# EAGLE design Adafruit FT232H (EAGLE 9.5.0)
COMPANY: ADAFRUIT INDUSTRIES; DRAWN: LADYADA; REV: A
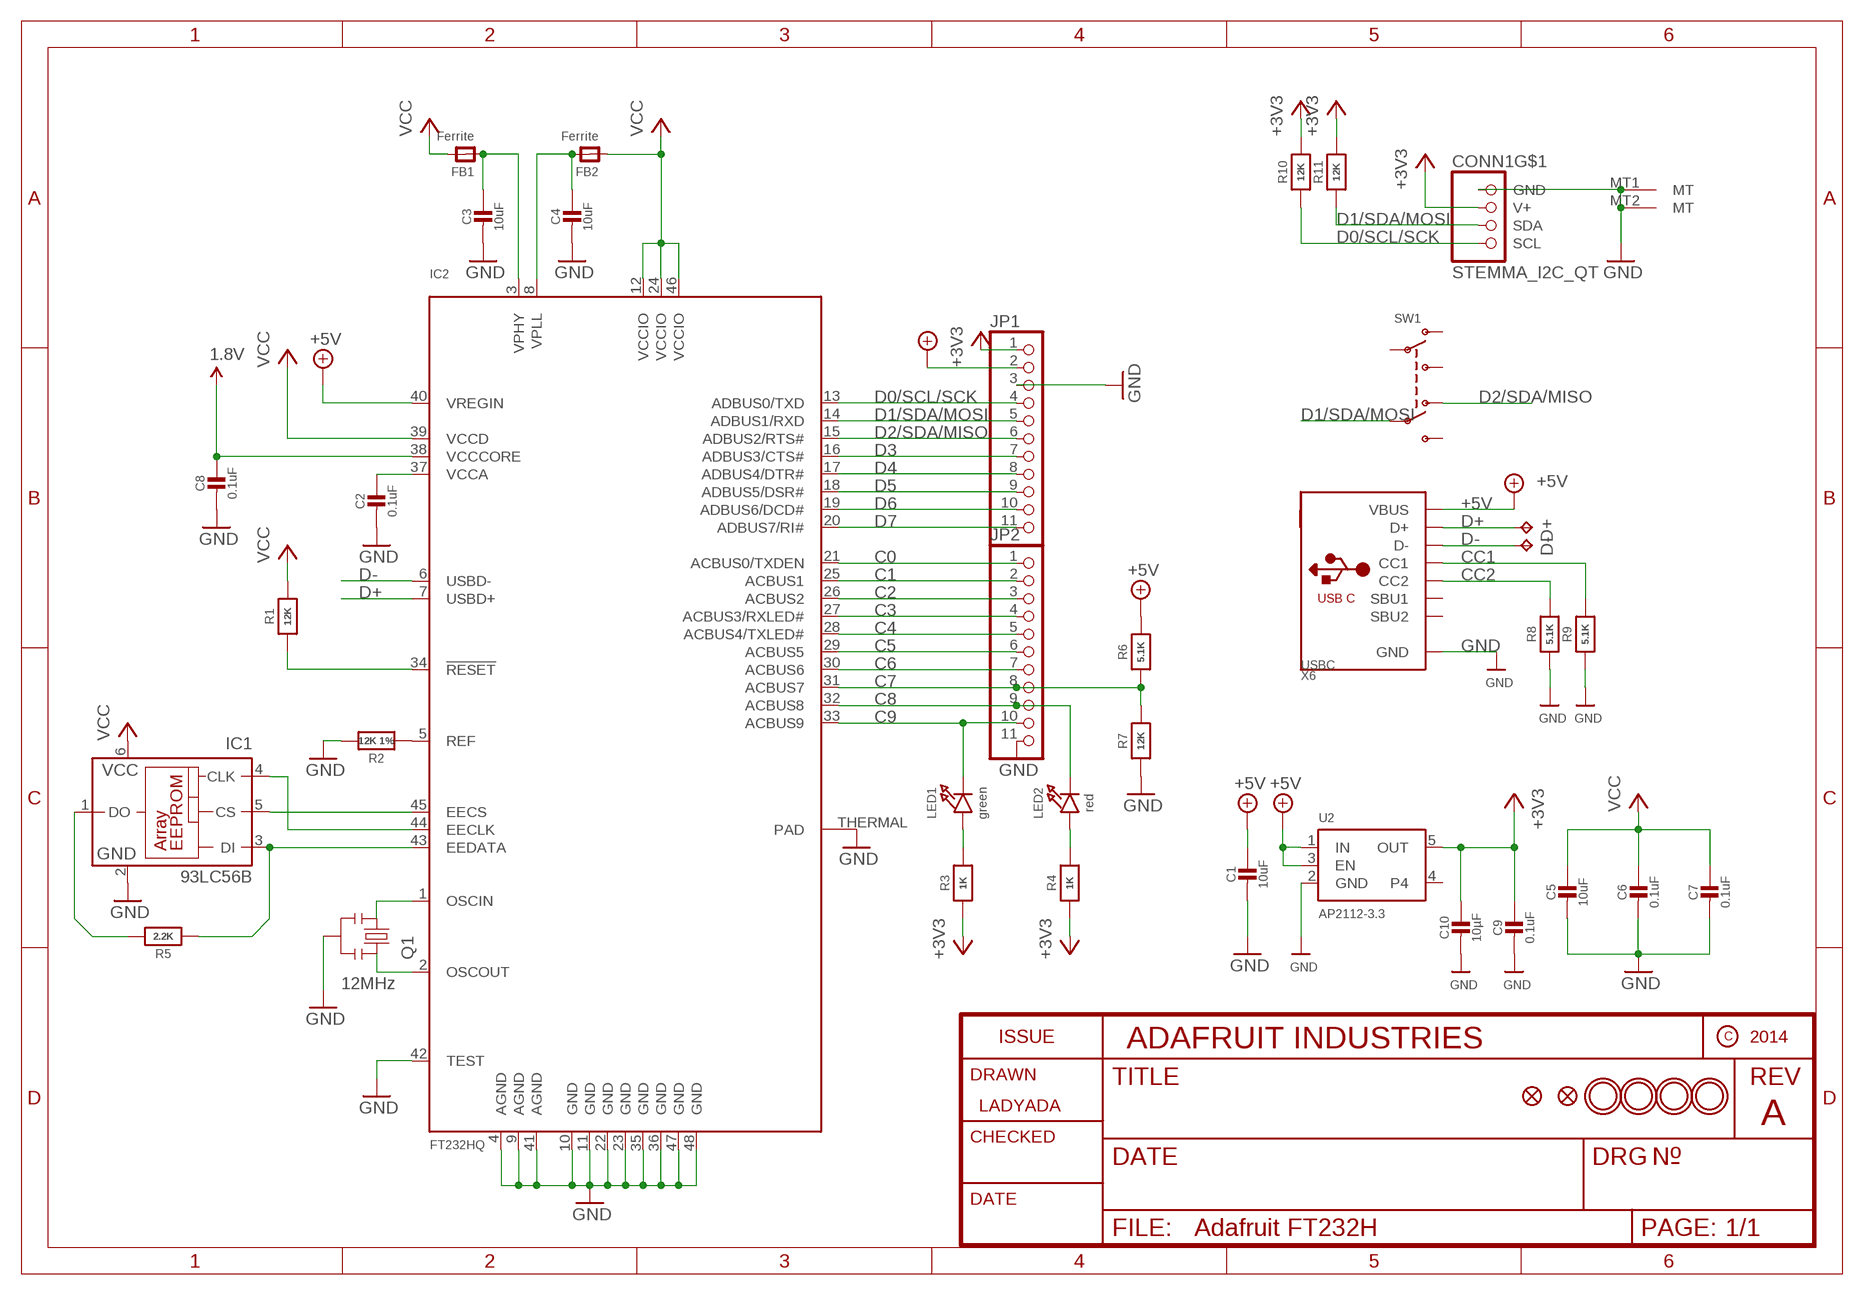
[diagram p0: schematic, sheet 1]

## Parts
C1  10uF  CAP_CERAMIC0805-NOOUTLINE  [0805-NO]
C2  0.1uF  CAP_CERAMIC0603_NO  [0603-NO]
C3  10uF  CAP_CERAMIC0805-NOOUTLINE  [0805-NO]
C4  10uF  CAP_CERAMIC0805-NOOUTLINE  [0805-NO]
C5  10uF  CAP_CERAMIC0805-NOOUTLINE  [0805-NO]
C6  0.1uF  CAP_CERAMIC0603_NO  [0603-NO]
C7  0.1uF  CAP_CERAMIC0603_NO  [0603-NO]
C8  0.1uF  CAP_CERAMIC0603_NO  [0603-NO]
C9  0.1uF  CAP_CERAMIC0603_NO  [0603-NO]
C10  10µF  CAP_CERAMIC0805-NOOUTLINE  [0805-NO]
CONN1  STEMMA_I2C_QT  [JST_SH4]
D+  TPTP17R  [TP17R]
D-  TPTP17R  [TP17R]
FB1  Ferrite  FERRITE_0805  [_0805]
FB2  Ferrite  FERRITE_0805  [_0805]
FID1  FIDUCIAL""  [FIDUCIAL_1MM]
FID2  FIDUCIAL""  [FIDUCIAL_1MM]
IC1  93LC56B  93LC76A  [SOT23-6]
IC2  FT232HQ  [QFN48_8MM]
JP1  HEADER-1X11  [1X11_ROUND]
JP2  HEADER-1X11  [1X11_ROUND]
LED1  green  LED0805_NOOUTLINE  [CHIPLED_0805_NOOUTLINE]
LED2  red  LED0805_NOOUTLINE  [CHIPLED_0805_NOOUTLINE]
Q1  12MHz  RESONATORSMD  [RESONATOR-SMD]
R1  12K  RESISTOR_0603_NOOUT  [0603-NO]
R2  12K 1%  RESISTOR_0603_NOOUT  [0603-NO]
R3  1K  RESISTOR_0603_NOOUT  [0603-NO]
R4  1K  RESISTOR_0603_NOOUT  [0603-NO]
R5  2.2K  RESISTOR_0603_NOOUT  [0603-NO]
R6  5.1K  RESISTOR_0603_NOOUT  [0603-NO]
R7  12K  RESISTOR_0603_NOOUT  [0603-NO]
R8  5.1K  RESISTOR_0603_NOOUT  [0603-NO]
R9  5.1K  RESISTOR_0603_NOOUT  [0603-NO]
R10  12K  RESISTOR_0603_NOOUT  [0603-NO]
R11  12K  RESISTOR_0603_NOOUT  [0603-NO]
SW1  SWITCH_DPDTEG1390  [EG1390]
U2  AP2112-3.3  VREG_SOT23-5  [SOT23-5]
U$4  MOUNTINGHOLE2.5  [MOUNTINGHOLE_2.5_PLATED]
U$5  MOUNTINGHOLE2.5  [MOUNTINGHOLE_2.5_PLATED]
U$6  MOUNTINGHOLE2.5  [MOUNTINGHOLE_2.5_PLATED]
U$7  MOUNTINGHOLE2.5  [MOUNTINGHOLE_2.5_PLATED]
X6  USBC  USB_C  [USB_C_CUSB31-CFM2AX-01-X]

## Nets
1.8V: C8.1 IC2.38(VCCCORE)
+3V3: C9.1 C10.1 CONN1.2(V+) JP1.1 R3.1 R4.1 R10.2 R11.2 U2.5(OUT)
+5V: C1.1 IC2.40(VREGIN) JP1.2 R6.2 U2.1(IN) U2.3(EN) X6.A4B9(VBUS) X6.B4A9(VBUS)
C0: IC2.21(ACBUS0/TXDEN) JP2.1
C1: IC2.25(ACBUS1) JP2.2
C2: IC2.26(ACBUS2) JP2.3
C3: IC2.27(ACBUS3/RXLED#) JP2.4
C4: IC2.28(ACBUS4/TXLED#) JP2.5
C5: IC2.29(ACBUS5) JP2.6
C6: IC2.30(ACBUS6) JP2.7
C7: IC2.31(ACBUS7) JP2.8 R6.1 R7.2
C8: IC2.32(ACBUS8) JP2.9 LED2.C
C9: IC2.33(ACBUS9) JP2.10 LED1.C
CC1: R9.2 X6.A5(CC1)
CC2: R8.2 X6.B5(CC2)
D0/SCL/SCK: CONN1.4(SCL) IC2.13(ADBUS0/TXD) JP1.4 R10.1
D1/SDA/MOSI: CONN1.3(SDA) IC2.14(ADBUS1/RXD) JP1.5 R11.1 SW1.P2
D2/SDA/MISO: IC2.15(ADBUS2/RTS#) JP1.6 SW1.O2
D3: IC2.16(ADBUS3/CTS#) JP1.7
D4: IC2.17(ADBUS4/DTR#) JP1.8
D5: IC2.18(ADBUS5/DSR#) JP1.9
D6: IC2.19(ADBUS6/DCD#) JP1.10
D7: IC2.20(ADBUS7/RI#) JP1.11
D+: D+.TP IC2.7(USBD+) X6.A6(D+) X6.B6(D+)
D-: D-.TP IC2.6(USBD-) X6.A7(D-) X6.B7(D-)
GND: C1.2 C2.2 C3.2 C4.2 C5.2 C6.2 C7.2 C8.2 C9.2 C10.2 CONN1.1(GND) CONN1.MT1(MT) CONN1.MT2(MT) IC1.2(GND) IC2.4(AGND) IC2.9(AGND) IC2.10(GND) IC2.11(GND) IC2.22(GND) IC2.23(GND) IC2.35(GND) IC2.36(GND) IC2.41(AGND) IC2.42(TEST) IC2.47(GND) IC2.48(GND) IC2.THERMAL(PAD) JP1.3 JP2.11 Q1.2 R2.2 R7.1 R8.1 R9.1 U2.2(GND) X6.A1B12(GND) X6.B1A12(GND)
N$2: IC2.1(OSCIN) Q1.1
N$3: IC2.2(OSCOUT) Q1.3
N$5: IC2.5(REF) R2.1
N$6: LED2.A R4.2
N$7: IC2.34(!RESET) R1.1
N$8: LED1.A R3.2
N$9: IC1.3(DI) IC2.43(EEDATA) R5.1
N$10: IC1.5(CS) IC2.45(EECS)
N$11: IC1.4(CLK) IC2.44(EECLK)
N$12: IC1.1(DO) R5.2
VCC: C5.1 C6.1 C7.1 FB1.2 FB2.1 IC1.6(VCC) IC2.12(VCCIO) IC2.24(VCCIO) IC2.39(VCCD) IC2.46(VCCIO) R1.2
VCCA: C2.1 IC2.37(VCCA)
VPHY: C3.1 FB1.1 IC2.3(VPHY)
VPLL: C4.1 FB2.2 IC2.8(VPLL)
Unconnected: SW1.O1 SW1.P1 SW1.S1 SW1.S2 U2.4 X6.A8(SBU1) X6.B8(SBU2)

## Library data of the parts
C1-C9 = microbuilder:CAP_CERAMIC: Ceramic Capacitors For new designs, use the packages preceded by an '_' character since they are more reliable: The following footprints should be used on most boards: _0402 - Standard footprint for regular board layouts _0603 - Standard footprint for regular board layouts _0805 - Standard footprint for regular board layouts _1206 - Standard footprint for regular board layouts For extremely tight-pitch boards where space is at a premium, the following 'micro-pitch' footprints can be used (smaller pads, no silkscreen outline, etc.): _0402MP - Micro-pitch footprint for very dense/compact boards _0603MP - Micro-pitch footprint for very dense/compact boards _0805MP - Micro-pitch footprint for very dense/compact boards _1206MP - Micro-pitch footprint for very dense/compact boards
C10 = microbuilder:CAP_CERAMIC: Ceramic Capacitors For new designs, use the packages preceded by an '_' character since they are more reliable: The following footprints should be used on most boards: _0402 - Standard footprint for regular board layouts _0603 - Standard footprint for regular board layouts _0805 - Standard footprint for regular board layouts _1206 - Standard footprint for regular board layouts For extremely tight-pitch boards where space is at a premium, the following 'micro-pitch' footprints can be used (smaller pads, no silkscreen outline, etc.): _0402MP - Micro-pitch footprint for very dense/compact boards _0603MP - Micro-pitch footprint for very dense/compact boards _0805MP - Micro-pitch footprint for very dense/compact boards _1206MP - Micro-pitch footprint for very dense/compact boards; REV: A
CONN1 = microbuilder:STEMMA_I2C
D+ D- = testpad:TP: Test pad
FB1 FB2 = microbuilder:FERRITE: Ferrite Bead 0603 MMZ1608B121C - 120 Ohm @ 100MHz, 600mA, 0.15 Ohm DC Resistance - Digikey: 445-2164-1-ND BK1608HW121-T - 120 Ohm, 600mA Ferrite Chip - Digikey: 587-1876-2-ND 0805 HZ0805B272R-10 - 2.7K Ohm @ 100MHz, 200mA, 0.8 Ohm DC Resistance - Digikey: 240-2504-1-ND (see also Murata BLM21BD272SN1L) MMZ2012Y152B - 1.5K Ohm @ 100MHz, 500mA, 0.4 Ohm DC Resistance - Digikey: 445-1560-1-ND - Mainly for high frequency (80-400MHz) MMZ2012R102A - 1K Ohm @ 100MHz, 500mA, 0.3 Ohm DC Resistance - Digikey: 445-1555-2-ND - More general purpose (10-200MHz)
FID1 FID2 = microbuilder:FIDUCIAL: Fiducial Alignment Points Various fiducial points for machine vision alignment.; BOM: EXCLUDE
IC1 = microchip:93*76?: 8K Microwire Compatible Serial EEPROM Source: http://ww1.microchip.com/downloads/en/DeviceDoc/21796H.pdf; MF: MICROCHIP; MPN: 93LC76AT-I/OT; OC_FARNELL: 1556170; OC_NEWARK: 61H6824
IC2 = microbuilder:FT232H
JP1 JP2 = microbuilder:HEADER-1X11
LED1 LED2 = microbuilder:LED: LED 0603 - 0603 Surface Mount Package 2mA: Green LED - Low Power (3.9mcd, 2ma, 1.7Vf) - Digikey: 475-2709-2-ND Orange LED - Low Power (9.8mcd, 2ma, 1.8Vf) - Digikey: 475-1194-2-ND Red LED - Low Power (5mcd, 2ma, 1.8Vf) - Digikey: 475-1195-2-ND Yellow LED - Low Power (7mcd, 2ma, 1.8Vf) - Digikey: 475-1196-2-ND 5mA: Blue LED - Low Power (17mcd, 5ma, 2.9Vf) - Digikey: LNJ937W8CRACT-ND 0805 - 0805 Surface Mount Package 2mA: Red LED (8.8mcd, 2mA, 1.8Vf, Clear) - Low Power [Digikey: 475-2510-1-ND] Green LED (5mcd, 2mA, 1.8Vf, Clear) - Low Power [Digikey: 475-2730-1-ND] Yellow LED (11.3mcd, 2mA, 1.8Vf, Clear) - Low Power [Digikey: 475-2555-1-ND] 20mA: Red LED (104mcd, 20mA, Diffused) - LS R976 [Digikey: 475-1278-6-ND] Red LED (12mcd, 20mA, 2.0Vf, Clear) - APT2012EC [Digikey: 754-1128-1-ND] Green LED (15mcd, 20mA, 2.2Vf, Clear) - APT2012GC [Digikey: 754-1131-1-ND] Orange LED (160mcd, 20mA, 2.1Vf, Clear) - APT2012SECK [Digikey: 754-1130-1-ND] 1206 - 1206 Surface Mount Package Green LED (26mcd, 20mA, Diffused) - LG N971 [Digikey: 475-1407-6-ND] Red LED (15mcd, 20mA, Diffused) - LH N974 [Digikey: 475-1416-6-ND] Cree - Cree High-Power Surface Mount LEDs XPEBWT-L1-0000-00D50 - White 111lm 350mA 2.9Vf 6200K 110° XTEAWT-00-0000-00000LEE3 - White 114lm 350mA 2.85Vf 5000K 115° Everlight - Everlight 45-21 Series Surface Mount LEDs 45-21/QK2C-B2832AC2CB2/2T - Warm White 2000mcd 20mA 3.25Vf 3050K 120° 45-21/LK2C-B38452C4CB2/2T - Nuetral White 2000mcd 20mA 3.25Vf 4150K 120° 45-21/LK2C-B50634C6CB2/2T - Cold White 2200mcd 20mA 3.25Vf 5650K 120° PLCC2 Reverse Mount LS T77K-J1L2-1-0-2-R18-Z - Red 11.25mcd 2mA 1.8Vf 630nm 120° LO T77K-L1M2-24-Z - Orange 19.6mcd 2mA 1.8Vf 606nm 120° LY T77K-K2M1-26-Z - Yellow 15.7mcd 2mA 1.8Vf 587nm 120°
Q1 = SparkFun:RESONATOR: Resonator Small SMD resonator. This is the itty bitty 10/20MHz resonators with built in caps. CSTCE10M0G55 and CSTCE20M0V53. Footprint has been reviewed closely but hasn't been tested yet.
R1-R11 = microbuilder:RESISTOR: Resistors For new designs, use the packages preceded by an '_' character since they are more reliable: The following footprints should be used on most boards: _0402 - Standard footprint for regular board layouts _0603 - Standard footprint for regular board layouts _0805 - Standard footprint for regular board layouts _1206 - Standard footprint for regular board layouts For extremely tight-pitch boards where space is at a premium, the following 'micro-pitch' footprints can be used (smaller pads, no silkscreen outline, etc.): _0402MP - Micro-pitch footprint for very dense/compact boards _0603MP - Micro-pitch footprint for very dense/compact boards _0805MP - Micro-pitch footprint for very dense/compact boards _1206MP - Micro-pitch footprint for very dense/compact boards
SW1 = microbuilder:SWITCH_DPDT: Switch - DPDT A DPDT Switch acts like an SPDT switch, but has a pair of switches instead of just one. Vertical - 0.3A @ 6V SMT - Digikey: JS202011SCQN
U2 = microbuilder:VREG_SOT23-5: SOT23-5 Fixed Voltage Regulators Part Current Out V Out V In V Dropout θJA (°C/W) TJ (°C) Digikey Part No. ADP121 150mA 3.3V 3.4-5.5V 0.09V @ 150mA -- -- ADP121-AUJZ33R7CT-ND ADP121 150mA 3.0V 3.1-5.5V 0.09V @ 150mA -- -- ADP121-AUJZ30R7CT-ND ADP122 300mA 3.3V 3.4-5.5V 0.085V @ 300mA -- -- ADP122AUJZ-3.3-R7CT-ND ADP1712 300mA 3.3V 3.5-5.5V 0.17V @ 300mA -- -- ADP1712AUJZ-3.3-R7TR-ND AP7311 (Low Cost) 150mA 3.3V 3.5-6V 0.15V @ 150mA -- -- AP7311-33WG-7DICT-ND LD39015M18R 150mA 1.8V 1.9V-5.5V 0.08V @ 100mA -- -- 497-6977-1-ND LP2985A-33DBVR 150mA 3.3V 3.3-16V 0.28V @ 150mA 206 150 296-18479-1-ND MCP1824T-3302E/OT 300mA 3.3V 3.5V-6V 0.2V @ 300mA -- -- MCP1824T-3302E/OTCT-ND MIC5205-2.5YM5 TR 150mA 2.5V 2.7-16V 0.165V @ 150mA -- -- 576-1257-2-ND MIC5205-3.0YM5 TR 150mA 3.0V 3.2V-16V 0.165V @ 150mA -- -- 576-1258-2-ND MIC5205-3.3YM5 TR 150mA 3.3V 3.5V-16V 0.165V @ 150mA -- -- 576-1259-2-ND TPS780330220 150mA 3.3V+2.2V 3.6-5.5V 250mV Max -- -- 296-23332-1-ND TDA3663/N1,135 100mA 3.3V 3.5-45V 0.18V @ 50mA -- -- 568-5343-1-ND Max operating temp can be calculated using θJA, TJ (max junction temperature), and power in watts. Set the "Maximum Ambient Temperature" until it reaches TJ ("Max Junction Temperature"), which is the absolute limit for safe use of the regulator: Heat Sink Temperature Calculator <http://www.daycounter.com/Calculators/Heat-Sink-Temperature-Calculator.phtml> For example, With 12V source into a 3.3V LP2985 and a 30mA load, we are dissipating (12V-3.3V) * 0.03A = 0.261W. With a θJA of 206 °C/W, a TJ of 150°C, and 261mW we can safely use the chip without a heat sink up to 75°C (=147.1°C Junction Temperature).
U$4 U$5 U$7 = microbuilder:MOUNTINGHOLE: Mounting Hole For #2 screws (0.086"/2.18mm width, 0.094"/2.4mm hole) use 2.5mm; BOM: EXCLUDE
U$6 = microbuilder:MOUNTINGHOLE: Mounting Hole For #2 screws (0.086"/2.18mm width, 0.094"/2.4mm hole) use 2.5mm; BOM: EXCLUDE; REV: D
X6 = microbuilder:USB_C: USB Type-C USB 2.0 Connector

## Net classes
1 power: width 0.305 mm
2 gnd: width 0.254 mm

## Board
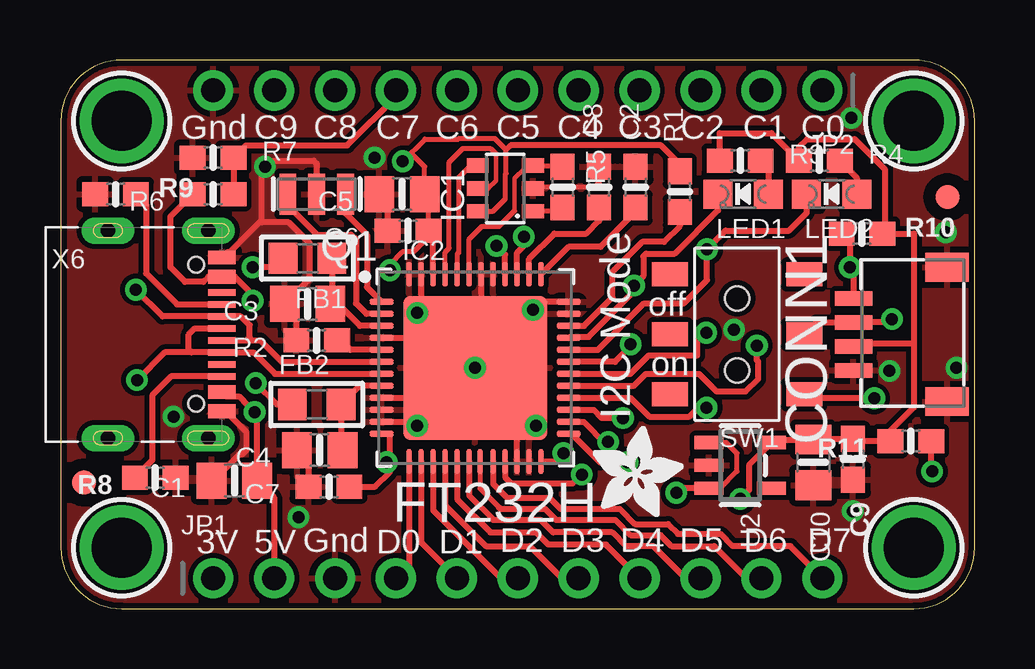
[diagram p1: board, top side]
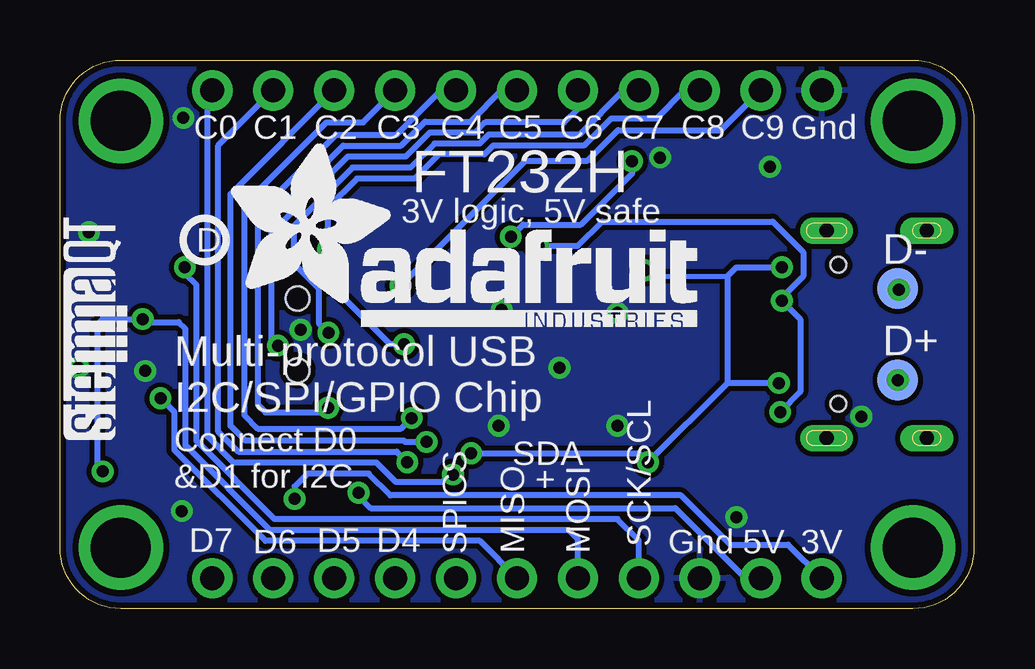
[diagram p2: board, bottom side, seen from below]

Size 38.1 x 22.86 mm. Coordinates in mm from the lower left corner, seen from the top.
Outline: 0,20.32 0,2.54 arc90 2.54,0 35.56,0 arc90 38.1,2.54 38.1,20.32 arc90 35.56,22.86 2.54,22.86 arc90 0,20.32
Copper layers (1*16): Top 0.035mm / dielectric 1.5mm / Bottom 0.035mm
Design rules "adafruit *": minimum track width 8mil, minimum drill 15.5mil, track to track 8mil, track to pad 8mil, pad to pad 8mil, via to via 8mil, smd to smd 8mil, copper to edge 10mil, drill to drill 8mil, minimum pad ring 10mil, minimum via ring 8mil, stop-mask expansion 2mil, vias tented up to drill 20mil, thermal gap 10mil

### Footprints (pad centres in the part's own frame; a part is rotated, then mirrored left to right if it is on the bottom)
0805-NO = smd 1.24 x 1.5: 1 -0.95,0; 2 0.95,0
0603-NO = smd 1.075 x 1: 1 -0.85,0; 2 0.85,0
JST_SH4 = smd 0.6 x 1.55: 1 -1.5,2.514; 2 -0.5,2.514; 3 0.5,2.514; 4 1.5,2.514 | smd 1.2 x 1.8: MT1 -2.8,-1.386; MT2 2.8,-1.386
TP17R = smd 1.7 x 1.7: TP 0,0
_0805 = smd 1.2 x 1.3: 1 -1.016,0; 2 1.016,0
FIDUCIAL_1MM = smd 1 x 1: 1 0,0
SOT23-6 = smd 0.6 x 0.9: 1 -0.95,-1.15; 2 0,-1.15; 3 0.95,-1.15; 4 0.95,1.15; 5 0,1.15; 6 -0.95,1.15
QFN48_8MM = smd 1 x 0.23: 1 -3.9,2.75; 2 -3.9,2.25; 3 -3.9,1.75; 4 -3.9,1.25; 5 -3.9,0.75; 6 -3.9,0.25; 7 -3.9,-0.25; 8 -3.9,-0.75; 9 -3.9,-1.25; 10 -3.9,-1.75; 11 -3.9,-2.25; 12 -3.9,-2.75; 25 3.9,-2.75; 26 3.9,-2.25; 27 3.9,-1.75; 28 3.9,-1.25; 29 3.9,-0.75; 30 3.9,-0.25; 31 3.9,0.25; 32 3.9,0.75; 33 3.9,1.25; 34 3.9,1.75; 35 3.9,2.25; 36 3.9,2.75 | smd 0.23 x 1: 13 -2.75,-3.9; 14 -2.25,-3.9; 15 -1.75,-3.9; 16 -1.25,-3.9; 17 -0.75,-3.9; 18 -0.25,-3.9; 19 0.2,-3.9; 20 0.75,-3.9; 21 1.25,-3.9; 22 1.75,-3.9; 23 2.25,-3.9; 24 2.75,-3.9; 37 2.75,3.9; 38 2.25,3.9; 39 1.75,3.9; 40 1.25,3.9; 41 0.75,3.9; 42 0.25,3.9; 43 -0.25,3.9; 44 -0.75,3.9; 45 -1.25,3.9; 46 -1.75,3.9; 47 -2.25,3.9; 48 -2.75,3.9 | smd 6 x 6: THERMAL 0,0
1X11_ROUND = drill 1 pad 1.676: 1 -12.7,0; 2 -10.16,0; 3 -7.62,0; 4 -5.08,0; 5 -2.54,0; 6 0,0; 7 2.54,0; 8 5.08,0; 9 7.62,0; 10 10.16,0; 11 12.7,0
CHIPLED_0805_NOOUTLINE = smd 1.2 x 1.2: A 0,-1.05; C 0,1.05
RESONATOR-SMD = smd 0.7 x 1.7: 1 -1.2,0; 2 0,0; 3 1.2,0
EG1390 = smd 1 x 1.5: O1 -2.5,2.8; O2 -2.5,-2.8; P1 0,2.8; P2 0,-2.8; S1 2.5,2.8; S2 2.5,-2.8 | hole 1: 1.5,0; -1.5,0
SOT23-5 = smd 0.55 x 1.2: 1 -0.95,-1.3; 2 0,-1.3; 3 0.95,-1.3; 4 0.95,1.3; 5 -0.95,1.3
MOUNTINGHOLE_2.5_PLATED = drill 2.5 pad 3.2: P$1 0,0
USB_C_CUSB31-CFM2AX-01-X = smd 0.575 x 1.15: A1B12 -3.2,3.545; A4B9 -2.4,3.545; B1A12 3.2,3.545; B4A9 2.4,3.545 | smd 0.275 x 1.15: A5 -1.25,3.545; A6 -0.25,3.545; A7 0.25,3.545; A8 1.25,3.545; B5 1.75,3.545; B6 0.75,3.545; B7 -0.75,3.545; B8 -1.75,3.545 | drill 0.6 pad 1 long: M1 -4.32,2.97; M2 4.32,2.97; M3 -4.32,-1.21; M4 4.32,-1.21 | hole 0.65: 2.89,2.47; -2.89,2.47

### Placement (x,y rotation side)
C1  7.24,5.33 180 top
C2  23.96,17.56 90 top
C3  10.29,12.7 180 top
C4  10.79,6.6 180 top
C5  14.22,17.27 180 top
C6  14.48,15.75 180 top
C7  11.18,5.08 180 top
C8  22.44,17.56 90 top
C9  33.02,6.22 270 top
C10  31.37,6.1 270 top
CONN1  35.56,11.43 90 top
D+  3.17,9.53 0 bottom
D-  3.17,13.34 0 bottom
FB1  10.29,14.61 180 top
FB2  10.67,8.51 0 top
FID1  0.97,5.26 0 top
FID2  36.96,17.14 0 top
IC1  18.54,17.51 90 top
IC2  17.27,10.03 0 top
JP1  19.05,1.27 0 top
JP2  19.05,21.59 180 top
LED1  28.45,17.27 90 top
LED2  32.13,17.27 90 top
Q1  10.67,17.27 180 top
R1  25.81,17.37 90 top
R2  10.67,11.18 180 top
R3  28.32,18.67 0 top
R4  31.62,18.67 0 top
R5  20.92,17.56 270 top
R6  6.35,17.27 180 top
R7  6.35,18.8 0 top
R8  3.94,5.46 180 top
R9  2.29,17.27 0 top
R10  33.4,15.62 0 top
R11  35.43,6.99 180 top
SW1  28.19,11.43 90 top
U2  28.32,5.97 270 top
U$2  [ADAFRUIT_3.5MM]  22.16,3.81 0 top
U$3  [ADAFRUIT_TEXT_20MM]  31.11,11.75 0 bottom
U$4  2.54,20.32 0 top
U$5  2.54,2.54 0 top
U$6  35.56,20.32 0 top
U$7  35.56,2.54 0 top
U$8  [STEMMAQT]  35.31,7.05 90 bottom
U$11  [PCBFEAT-REV-040]  32.07,15.37 0 bottom
X6  3.17,11.43 270 top

### Tracks (layer width: path | path; a pad name or v marks a point on that pad's centre or on a via)
1.8V
  Top 0.254: IC2.38 19.52,14.57 20.57,15.62 21.91,15.62 22.44,16.15 C8.1
+3V3  (via drill 0.5)
  Top 0.254: v28.32,4.57 28.69,4.94 28.69,5.99 U2.5 29.75,7.05 C10.1 31.4,7.07 C9.1 33.11,6.99 R11.2 34.58,7.41 35.56,8.38 35.56,11.05 | R3.1 27.47,19.81 29.63,19.81 R4.1 30.77,19.22 31.11,19.56 33.1,19.56 34.35,18.3 34.35,15.62 | 35.56,11.05 35.56,15.62 34.35,15.62 | R10.2 34.35,15.62 | CONN1.2 33.16,11.05 35.56,11.05
  Bottom 0.254: JP1.1 7.75,2.67 10.16,2.67 12.21,4.72 24.33,4.72 25.23,5.63 27.77,5.63 28.32,5.08 v28.32,4.57
+5V  (via drill 0.5)
  Top 0.203: U2.3 27.5,5.02 28.19,5.71 28.19,6.48 27.75,6.92 U2.1
  Top 0.254: JP1.2 8.89,4.63 C1.1 8.19,8.08 v8.08,8.19 7.62,8.64 7.62,8.65 7.43,8.85 6.9,8.85 X6.B4A9 | v8,12.83 8,13.08 7.25,13.83 X6.A4B9 6.15,13.83 5.94,13.61 5.18,13.61 4.57,14.22 4.57,16.34 R6.2 | IC2.40 18.52,14.75 v18.16,15.11 | U2.3 25.85,5.02 v25.65,4.83
  Bottom 0.254: v18.16,15.11 16.51,15.11 15.49,16.13 8.38,16.13 7.11,14.86 7.11,13.84 8,12.95 v8,12.83 7.24,12.06 7.24,9.03 v8.08,8.19 | JP1.2 9.53,1.27 12.45,4.19 25.15,4.19 25.65,4.7 v25.65,4.83
C0  (via drill 0.5)
  Top 0.254: IC2.21 18.52,5.48 18.8,5.21 21.34,5.21 v21.72,5.59
  Bottom 0.254: v21.72,5.59 21.84,5.59 22.16,5.27 24.09,5.27 24.9,6.08 30.86,6.08 31.95,7.18 31.95,21.39 JP2.1
C1  (via drill 0.5)
  Top 0.254: v23.62,6.1 22.49,6.1 21.3,7.28 IC2.25
  Bottom 0.254: JP2.2 31.5,19.3 31.5,7.37 30.67,6.54 24.07,6.54 v23.62,6.1
C2  (via drill 0.5)
  Top 0.254: v22.82,6.94 22.73,6.86 21.81,7.78 IC2.26
  Bottom 0.254: v22.82,6.94 23.71,6.94 23.77,7.01 30.38,7.01 30.99,7.62 30.99,17.27 JP2.3
C3  (via drill 0.5)
  Top 0.254: v23.44,7.94 22.55,7.94 22.21,8.28 IC2.27
  Bottom 0.254: v23.44,7.94 23.88,7.5 29.85,7.5 30.42,8.07 30.42,16.82 26.99,20.26 25.46,20.26 JP2.4
C4  (via drill 0.5)
  Top 0.254: v26.92,8.37 26.58,8.37 26.21,8.01 24.53,8.01 23.75,8.78 IC2.28
  Bottom 0.254: v26.92,8.37 27.11,8.18 29.53,8.18 29.84,8.5 29.84,16.5 26.59,19.75 24.07,19.75 22.23,21.59 JP2.5
C5  (via drill 0.5)
  Top 0.254: IC2.29 23.89,9.28 24.38,9.78 26.61,9.78 27.34,9.05 28.56,9.05 29.07,9.56 29.07,10.29 29.02,10.35 v29.02,10.96
  Bottom 0.254: v29.02,10.96 29.27,11.22 29.27,16.31 26.29,19.29 23.88,19.29 22.87,20.3 20.98,20.3 19.68,21.59 JP2.6
C6  (via drill 0.5)
  Top 0.254: IC2.30 23.74,9.78 24.51,10.55 26.53,10.55 26.53,11.11 v26.91,11.49
  Bottom 0.254: v26.91,11.49 27.31,11.9 27.31,13.34 28.81,14.84 28.81,16.12 26.1,18.83 23.69,18.83 22.68,19.84 20.79,19.84 20.37,20.26 17.08,20.26 16.51,20.83 JP2.7
C7  (via drill 0.5)
  Top 0.254: R6.1 R7.2 7.71,19.3 11.94,19.3 13.97,21.34 JP2.8 | v23.75,11.02 23.78,10.99 23.82,10.99 23.11,10.28 IC2.31
  Bottom 0.254: JP2.8 14.61,21.59 16.45,19.75 20.23,19.75 20.6,19.38 22.5,19.38 23.5,18.38 25.91,18.38 28.36,15.93 28.36,15.03 24.34,11.02 v23.75,11.02
C8  (via drill 0.5)
  Top 0.254: IC2.32 22.38,10.78 24.32,12.72 25.97,12.72 26.94,13.69 v26.94,14.97 27.71,15.75 30.35,15.75 31.08,16.48 LED2.C
  Bottom 0.254: JP2.9 12.06,21.59 13.23,20.42 15.13,20.42 16.26,19.29 20.04,19.29 20.41,18.92 22.31,18.92 23.31,17.92 25.72,17.92 26.94,16.71 v26.94,14.97
C9  (via drill 0.5)
  Top 0.254: IC2.33 21.21,11.33 22,11.33 23.9,13.22 v23.9,13.46 24.28,13.84 24.28,14.67 24.4,14.8 25.59,14.8 27.4,16.6 LED1.C
  Bottom 0.254: v23.9,13.46 18.69,18.67 16.11,18.67 14.84,19.94 10.54,19.94 JP2.10
CC1
  Top 0.254: R9.2 3.56,16.85 3.56,13.97 4.85,12.68 X6.A5
CC2
  Top 0.254: X6.B5 4.6,9.68 3.81,8.89 3.81,6.18 R8.2
D0/SCL/SCK  (via drill 0.5)
  Top 0.254: IC2.13 14.52,1.82 JP1.4 | CONN1.4 33.05,14.07 v32.89,14.22 32.89,15.28 R10.1
  Bottom 0.254: JP1.4 13.97,2.85 14.86,3.73 29.16,3.73 32.41,6.99 32.41,13.49 32.89,13.97 v32.89,14.22
D1/SDA/MOSI  (via drill 0.5)
  Top 0.254: IC2.14 15.02,2.76 JP1.5 | v34.65,12.06 34.52,11.93 CONN1.3 31.49,11.93 SW1.P2 | v36.32,5.71 36.28,5.75 R11.1
  Bottom 0.254: JP1.5 16.51,2.9 16.89,3.28 29.35,3.28 32.87,6.8 32.87,11.66 33.15,11.94 34.52,11.94 v34.65,12.06 36.32,12.06 36.55,11.83 36.55,5.95 v36.32,5.71
D2/SDA/MISO  (via drill 0.5)
  Top 0.254: IC2.15 15.52,4.1 18.35,1.27 JP1.6 | v33.91,8.76 31.16,8.76 SW1.O2
  Bottom 0.254: JP1.6 20.6,2.82 29.54,2.82 33.33,6.61 33.33,8.18 v33.91,8.76
D3
  Top 0.254: IC2.16 16.02,4.3 17.72,2.6 19.56,2.6 20.89,1.27 JP1.7
D4
  Top 0.254: IC2.17 16.52,4.56 17.91,3.17 19.81,3.17 20.32,2.67 22.73,2.67 JP1.8
D5
  Top 0.254: IC2.18 17.02,4.71 18.03,3.7 20,3.7 20.52,3.17 22.99,3.17 23.56,2.6 24.7,2.6 26.04,1.27 JP1.9
D6
  Top 0.203: IC2.19 17.47,5.01 18.26,4.22
  Top 0.254: JP1.10 28.57,1.27 27.24,2.6 25.46,2.6 25.01,3.06 23.75,3.06 23.11,3.7 20.65,3.7 20.19,4.15 18.33,4.15 18.26,4.22
D7
  Top 0.254: IC2.20 18.02,5.19 18.61,4.61 20.38,4.61 20.84,4.15 23.3,4.15 23.94,3.52 25.31,3.52 25.72,3.11 27.5,3.11 28,2.6 30.42,2.6 JP1.11
D+  (via drill 0.5)
  Top 0.254: X6.B6 8.04,10.68 8.93,9.78 IC2.7 | X6.B6 5.45,10.68 5.33,10.79 5.33,11.43 5.58,11.68 X6.A6 | X6.B6 4.33,10.68 D+.TP
  other vias: 3.17,9.53
D-  (via drill 0.5)
  Top 0.254: X6.A7 7.75,11.18 | 7.75,11.18 8.31,11.18 9.21,10.28 IC2.6 | 7.75,11.18 7.87,11.31 7.87,11.81 7.5,12.18 X6.B7 4.24,12.18 v3.13,13.29
  Bottom 0.254: v3.13,13.29 D-.TP
GND  (via drill 0.5)
  Top 0.203: C8.2 22.44,17.74 22.27,17.57 19.75,17.57 IC1.2
  Top 0.254: X6.A1B12 6.96,14.87 7.07,14.87 8.38,16.18 | Q1.2 10.67,18.54 10.54,18.67 8.76,18.67 8.38,18.29 8.38,16.18 | 8.38,16.18 8.38,16.09 9.5,16.09 10.37,15.22 10.37,13.74 C3.2 9.82,12.22 R2.2 | C5.2 13.63,16.92 C6.2 | IC2.42 17.52,11.94 | 17.52,11.94 17.52,10.28 IC2.THERMAL 17.27,9.78 17.14,9.65 | IC2.47 15.02,11.27 | 15.02,11.27 16.76,9.53 17.02,9.53 | 17.02,9.53 17.14,9.65 | IC2.4 15.01,11.28 15.02,11.27 | IC2.9 16.28,8.78 | 16.28,8.78 17.02,9.53 | IC2.11 15.28,7.78 16.28,8.78 | IC2.22 19.02,7.9 17.27,9.65 17.14,9.65 | IC2.36 18.37,12.78 17.52,11.94 | X6.B1A12 6.87,8.23 7.73,7.37 7.73,6.59 7.56,6.41 7.43,6.41 6.35,5.33 C1.2 | C4.2 10.33,6.12 C7.2
  other vias: 8.51,18.41 13.08,18.8 14.86,12.32 19.68,12.45 14.86,7.62 19.81,7.62 17.27,10.03 33.02,4.06 37.34,10.03 34.54,9.91 4.7,8 9.91,3.81 28.07,11.62 36.89,15.68 32.96,20.45
  pour Top: 0,22.86 38.1,22.86 38.1,0 0,0
  pour Bottom: 0,22.86 38.1,22.86 38.1,0 0,0
N$2
  Top 0.254: Q1.1 11.87,16.46 12.76,15.57 12.76,13.39 IC2.1
N$3
  Top 0.254: Q1.3 9.54,17.2 9.54,16.73 10.69,15.59 12.1,15.59 12.3,15.38 12.3,12.72 12.74,12.28 IC2.2
N$5
  Top 0.254: IC2.5 12.08,10.78 11.68,11.18 R2.1
N$6
  Top 0.254: R4.2 33.18,17.96 LED2.A
N$7
  Top 0.254: R1.1 25.81,15.94 25.15,15.28 24.24,15.28 23,14.04 23,12.97 21.82,11.78 IC2.34
N$8
  Top 0.254: R3.2 29.5,18.34 LED1.A
N$9
  Top 0.178: 19.33,18.33 18.92,17.93 18.92,16.57
  Top 0.203: IC2.43 17.02,15.4 17.55,15.93 18.28,15.93 18.92,16.57 | R5.1 20.88,18.46 IC1.3 19.56,18.33 19.33,18.33
N$10
  Top 0.178: 18.14,18.95 18.14,17.83 17.82,17.51
  Top 0.203: IC2.45 16.02,14.85 16.19,15.02 16.19,18.61 16.76,19.18 17.91,19.18 18.14,18.95 | 17.82,17.51 IC1.5
N$11
  Top 0.203: IC2.44 16.52,14.77 16.6,14.85 16.6,17.97 17.09,18.46 IC1.4
N$12
  Top 0.203: R5.2 20.77,16.56 IC1.1
VCC  (via drill 0.5)
  Top 0.203: v13.72,14.1 13.72,14.35 14.23,14.87 14.7,14.87 15.33,15.49 C6.1 15.33,17.12 C5.1 15.17,18.41 14.6,18.98 v14.26,18.64 15.18,19.56 16.57,19.56 16.6,19.58 18.1,19.58 18.57,19.12 | IC1.6 18.02,16.56 18.53,17.07 18.53,18.09 18.57,18.13 18.57,19.12 | 18.75,19.3 18.57,19.12
  Top 0.254: IC2.12 13.72,7.28 13.72,6.1 | C7.1 13.1,5.08 13.72,5.69 13.72,6.1 | v20.95,6.48 20.61,6.13 IC2.24 | v13.59,6.1 13.72,6.1 | FB2.1 9.02,8.51 v8.13,9.4 | FB1.2 8.89,14.22 v8,14.22 | IC2.39 19.02,14.83 19.49,15.3 v19.3,15.49 | R1.2 25.81,18.52 25.02,19.3 18.75,19.3 | IC2.46 15.52,15.55 C6.1
  Bottom 0.203: v13.72,14.1 13.34,14.1 13.08,13.84 10.29,13.84
  Bottom 0.254: v20.95,6.48 13.97,6.48 v13.59,6.1 10.29,9.4 | v8.13,9.4 10.29,9.4 | v8,14.22 9.91,14.22 10.29,13.84 10.29,9.4 | v19.3,15.49 18.8,16 16.38,16 14.26,18.13 v14.26,18.64
VCCA
  Top 0.254: IC2.37 21.16,15.08 22.51,15.08 23.96,16.54 C2.1
VPHY
  Top 0.254: IC2.3 12.47,11.78 11.56,12.7 C3.1 11.3,12.77 FB1.1
VPLL
  Top 0.254: IC2.8 12.46,9.28 FB2.2 11.68,6.67 C4.1

### Text on the board
tPlace: Gnd | C9 | C8 | C7 | C6 | C5 | C4 | C3 | C2 | C1 | C0 | off | I2C Mode | on | FT232H | 3V | 5V | Gnd | D0 | D1 | D2 | D3 | D4 | D5 | D6 | D7
bPlace: Gnd | C9 | C8 | C7 | C6 | C5 | C4 | C3 | C2 | C1 | C0 | FT232H | 3V logic, 5V safe | Multi-protocol USB / I2C/SPI/GPIO Chip | SCK/SCL | SDA | Connect D0 / &D1 for I2C | + | MOSI | MISO | SPICS | 3V | 5V | Gnd | D4 | D5 | D6 | D7